# EAGLE design SensorBoards (EAGLE 6.6.0)
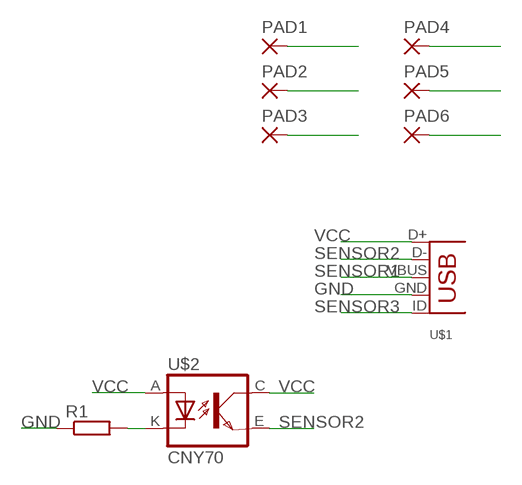
[diagram p0: schematic, sheet 1]

## Parts
PAD1  WIREPADSMD2,54-5,08  [SMD2,54-5,08]
PAD2  WIREPADSMD2,54-5,08  [SMD2,54-5,08]
PAD3  WIREPADSMD2,54-5,08  [SMD2,54-5,08]
PAD4  WIREPADSMD2,54-5,08  [SMD2,54-5,08]
PAD5  WIREPADSMD2,54-5,08  [SMD2,54-5,08]
PAD6  WIREPADSMD2,54-5,08  [SMD2,54-5,08]
R1  RCL_R-EU_R0805  [RCL_R0805]
U$1  MOLES-USB-MICRO  [MOLEX-USB-MICRO]
U$2  CNY70  [4]

## Nets
GND: PAD3.1(P) PAD6.1(P) R1.1 U$1.GND
N$1: R1.2 U$2.K(C)
SENSOR1: PAD2.1(P) U$1.VBUS
SENSOR2: U$1.D- U$2.E(EMI)
SENSOR3: PAD5.1(P) U$1.ID
VCC: PAD1.1(P) PAD4.1(P) U$1.D+ U$2.A U$2.C(COL)

## Library data of the parts
PAD1-PAD6 = wirepad:WIREPAD: Wire PAD connect wire on PCB
R1 = ScyllAlarmV3.0:RCL_R-EU_: RESISTOR, European symbol
U$1 = tom:MOLES-USB-MICRO
U$2 = cny70:CNY70

## Board
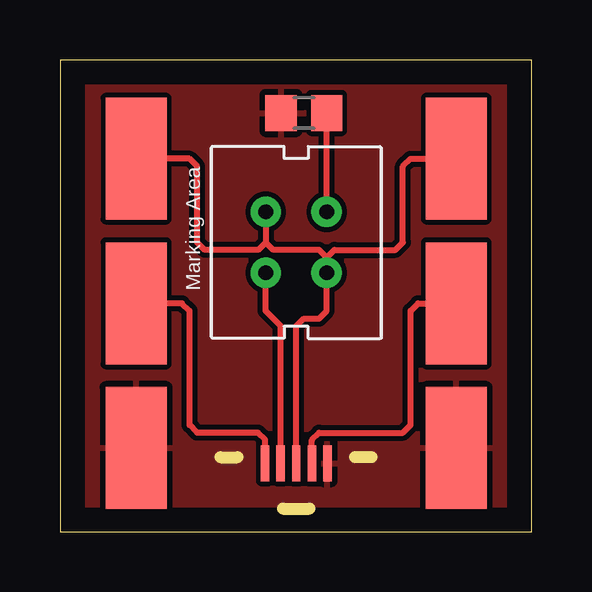
[diagram p1: board, top side]

Size 19.66 x 19.67 mm. Coordinates in mm from the lower left corner, seen from the top.
Outline: 0,0 19.66,0 19.66,19.67 0,19.67 0,0
Copper layers (1*16): Top 0.035mm / dielectric 1.5mm / Bottom 0.035mm
Design rules "default": minimum track width 10mil, minimum drill 24mil, track to track 8mil, track to pad 8mil, pad to pad 8mil, via to via 8mil, smd to smd 8mil, copper to edge 40mil, drill to drill 8mil, minimum pad ring 10mil, minimum via ring 8mil, stop-mask expansion 4mil, vias tented up to drill 0mil, thermal gap 10mil

### Footprints (pad centres in the part's own frame; a part is rotated, then mirrored left to right if it is on the bottom)
SMD2,54-5,08 = smd 2.54 x 5.08: 1 0,0
RCL_R0805 = smd 1.3 x 1.5: 1 -0.95,0; 2 0.95,0
MOLEX-USB-MICRO = smd 0.35 x 1.5: D+ 0,0; D- -0.65,0; GND 1.3,0; ID 0.65,0; VBUS -1.3,0
4 = drill 0.61 pad 1.27: A -1.27,1.27; C 1.27,-1.27; E 1.27,1.27; K -1.27,-1.27

### Placement (x,y rotation side)
PAD1  3.17,15.56 0 top
PAD2  3.17,9.53 0 top
PAD3  3.17,3.49 0 top
PAD4  16.51,15.56 180 top
PAD5  16.51,9.53 180 top
PAD6  16.51,3.49 180 top
R1  10.16,17.46 0 top
U$1  9.84,2.86 0 top
U$2  9.84,12.06 180 top

### Tracks (layer width: path | path; a pad name or v marks a point on that pad's centre or on a via)
GND
  pour Top: 0,19.68 19.68,19.68 19.68,0 0,0
N$1
  Top 0.254: U$2.K 11.11,16.82 R1.2
SENSOR1
  Top 0.254: U$1.VBUS 8.54,3.84 8.26,4.13 5.71,4.13 5.4,4.45 5.4,9.21 5.08,9.53 PAD2.1
SENSOR2
  Top 0.254: U$1.D- 9.19,8.59 8.57,9.21 U$2.E
SENSOR3
  Top 0.254: U$1.ID 10.49,3.83 10.79,4.13 14.29,4.13 14.61,4.45 14.61,9.21 14.92,9.53 PAD5.1
VCC
  Top 0.254: U$1.D+ 9.84,8.57 10.16,8.89 10.79,8.89 11.11,9.21 U$2.A 11.11,11.43 | 11.11,11.43 10.79,11.75 8.89,11.75 8.57,12.06 | U$2.C 8.57,12.06 | 8.57,12.06 8.26,11.75 6.03,11.75 5.71,12.06 5.71,15.24 5.4,15.56 PAD1.1 | 11.11,11.43 11.43,11.75 13.97,11.75 14.29,12.06 14.29,15.24 14.61,15.56 PAD4.1